# Altium schematic sheet Sheet1.SchDoc
size A4
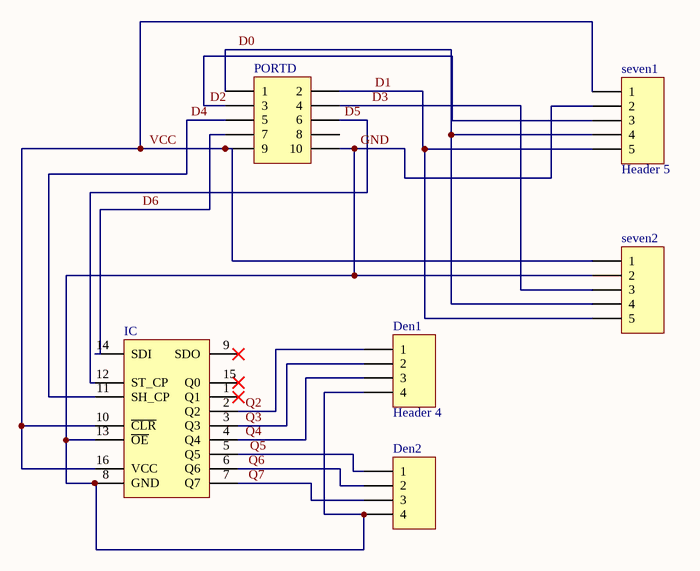
[diagram p0: Sheet1.SchDoc]

## Parts
Den1  Header 4  [HDR1X4]
Den2  Header 4  [HDR1X4]  (value not drawn)
IC  74HC595  [DIP 16]  (value not drawn)
PORTD  Header 5X2  [HDR2X5]  (value not drawn)
seven1  Header 5  [HDR1X5]
seven2  Header 5  [HDR1X5]  (value not drawn)

## Nets
D0: PORTD.1 seven1.4 seven2.4
D1: PORTD.2 seven1.5 seven2.5
D2: PORTD.3 seven1.3
D3: PORTD.4 seven2.3
D4: IC.11(SH_CP) PORTD.5
D5: IC.12(ST_CP) PORTD.6
D6: IC.14(SDI) PORTD.7
GND: Den1.4 Den2.4 IC.8(GND) IC.13(~{OE}) PORTD.10 seven1.2 seven2.2
Q2: Den1.1 IC.2(Q2)
Q3: Den1.2 IC.3(Q3)
Q4: Den1.3 IC.4(Q4)
Q5: Den2.1 IC.5(Q5)
Q6: Den2.2 IC.6(Q6)
Q7: Den2.3 IC.7(Q7)
VCC: IC.10(~{CLR}) IC.16(VCC) PORTD.9 seven1.1 seven2.1

Not connected (* = marked no-connect by the designer): IC 1(Q1)* 9(SDO)* 15(Q0)*; PORTD 8

## Library data of the parts
Den1 Den2 = Header 4: Header, 4-Pin; LatestRevisionDate: 17-Jul-2002; LatestRevisionNote: Re-released for DXP Platform.; Publisher: Altium Limited
IC = 74HC595: 8-bit serial-in, serial or parallel-out  shift register with output latches;  3-state
PORTD = Header 5X2: Header, 5-Pin, Dual row; LatestRevisionDate: 17-Jul-2002; LatestRevisionNote: Re-released for DXP Platform.; Publisher: Altium Limited
seven1 seven2 = Header 5: Header, 5-Pin; LatestRevisionDate: 17-Jul-2002; LatestRevisionNote: Re-released for DXP Platform.; Publisher: Altium Limited